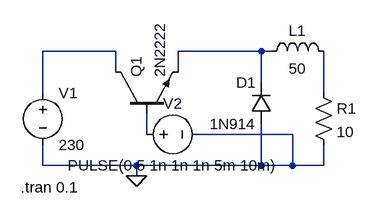
[diagram p0: schematic Chopper_Basic_R.asc]
Chopper_Basic_R.asc, the LTspice schematic file:
Version 4
SHEET 1 880 680
WIRE 176 64 64 64
WIRE 400 64 272 64
WIRE 416 64 400 64
WIRE 176 96 176 64
WIRE 272 96 272 64
WIRE 400 112 400 64
WIRE 64 128 64 64
WIRE 496 128 496 64
WIRE 224 192 224 160
WIRE 448 192 304 192
WIRE 64 240 64 208
WIRE 208 240 64 240
WIRE 400 240 400 176
WIRE 400 240 208 240
WIRE 448 240 448 192
WIRE 448 240 400 240
WIRE 496 240 496 208
WIRE 496 240 448 240
WIRE 208 256 208 240
FLAG 208 256 0
SYMBOL voltage 64 112 R0
WINDOW 123 0 0 Left 0
WINDOW 39 0 0 Left 0
SYMATTR InstName V1
SYMATTR Value 230
SYMBOL res 480 112 R0
SYMATTR InstName R1
SYMATTR Value 10
SYMBOL npn 176 160 R270
SYMATTR InstName Q1
SYMATTR Value 2N2222
SYMBOL voltage 208 192 R270
WINDOW 0 32 56 VTop 2
WINDOW 3 -32 56 VBottom 2
WINDOW 123 0 0 Left 0
WINDOW 39 0 0 Left 0
SYMATTR InstName V2
SYMATTR Value PULSE(0 5 1n 1n 1n 5m 10m)
SYMBOL ind 400 80 R270
WINDOW 0 32 56 VTop 2
WINDOW 3 5 56 VBottom 2
SYMATTR InstName L1
SYMATTR Value 50
SYMBOL diode 416 176 R180
WINDOW 0 24 64 Left 2
WINDOW 3 24 0 Left 2
SYMATTR InstName D1
SYMATTR Value 1N914
TEXT 30 274 Left 2 !.tran 0.1

The netlist it stands for:
* Chopper_Basic_R.asc
V1 N001 0 230
R1 N003 0 10
Q1 N001 N004 N002 0 2N2222
V2 N004 0 PULSE(0 5 1n 1n 1n 5m 10m)
L1 N002 N003 50
D1 0 N002 1N914
.model D D
.lib standard.dio
.model NPN NPN
.model PNP PNP
.lib standard.bjt
.tran 0.1
.backanno
.end